# EasyEDA Pro project inverted_board1.eprj

# Schematic Schematic1
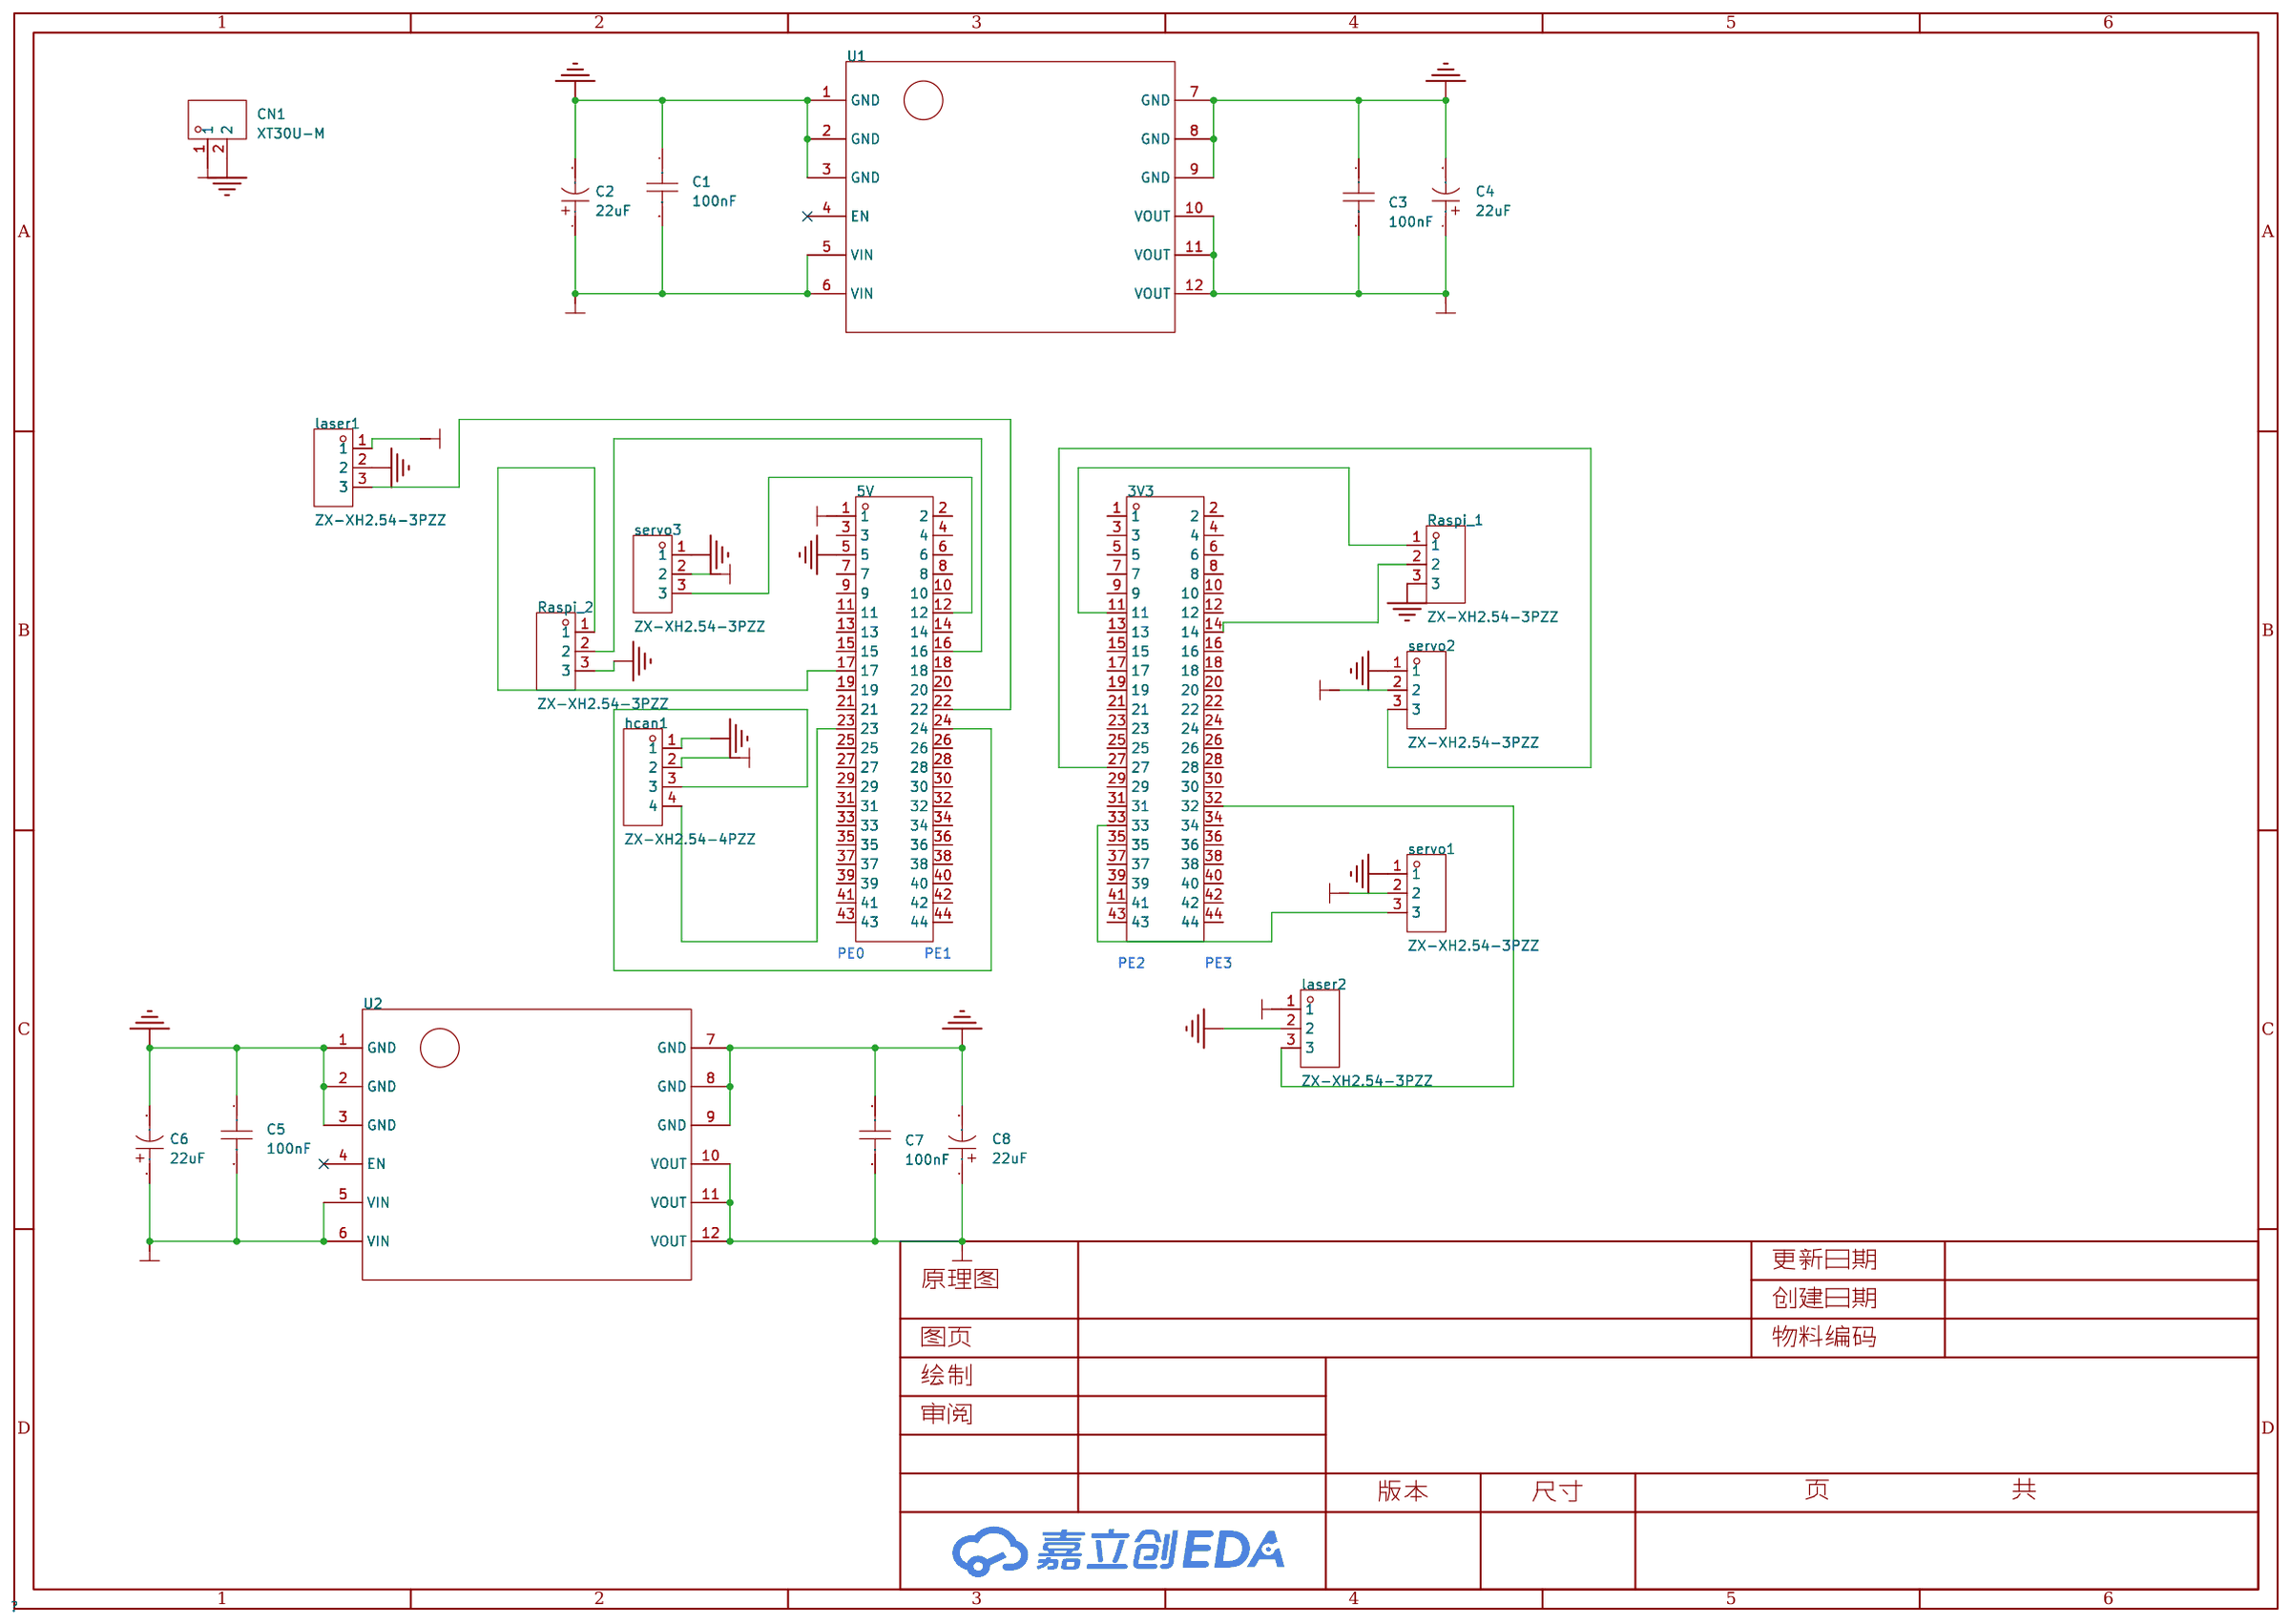
[diagram p0: schematic sheet]

## Parts
3V3  X6521FV-2x22-C85D32  [HDR-TH_44P-P2.54-V-F-R2-C22-S2.54]
5V  X6521FV-2x22-C85D32  [HDR-TH_44P-P2.54-V-F-R2-C22-S2.54]
C1  100nF  [C0603]
C2  22uF  [CAP-TH_BD8.0-P5.00-D0.6-FD]
C3  100nF  [C0603]
C4  22uF  [CAP-TH_BD8.0-P5.00-D0.6-FD]
C5  100nF  [C0603]
C6  22uF  [CAP-TH_BD8.0-P5.00-D0.6-FD]
C7  100nF  [C0603]
C8  22uF  [CAP-TH_BD8.0-P5.00-D0.6-FD]
CN1  XT30U-M  [CONN-TH_XT30U-M]
hcan1  ZX-XH2.54-4PZZ  [CONN-TH_4P-P2.50_4PIN]
laser1  ZX-XH2.54-3PZZ  [CONN-TH_3P-P2.54_2501S-3P]
laser2  ZX-XH2.54-3PZZ  [CONN-TH_3P-P2.54_2501S-3P]
Raspi_1  ZX-XH2.54-3PZZ  [CONN-TH_3P-P2.54_2501S-3P]
Raspi_2  ZX-XH2.54-3PZZ  [CONN-TH_3P-P2.54_2501S-3P]
servo1  ZX-XH2.54-3PZZ  [CONN-TH_3P-P2.54_2501S-3P]
servo2  ZX-XH2.54-3PZZ  [CONN-TH_3P-P2.54_2501S-3P]
servo3  ZX-XH2.54-3PZZ  [CONN-TH_3P-P2.54_2501S-3P]
U1  -  [TPS5430]
U2  -  [TPS5430]

## Library data of the parts
3V3 5V = X6521FV-2x22-C85D32: LCSC Part Name: 间距:2.54mm 2x22P 直插; Supplier Part: C2883995; Manufacturer: XKB Connection(中国星坤); Supplier Footprint: 插件,P=2.54mm; JLCPCB Part Class: 扩展库; Datasheet: https://atta.szlcsc.com/upload/public/pdf/source/20211009/C636DBF0733662F7F428F4420CCBBD46.pdf; Supplier: LCSC; Holes Structure: 2x22P; Pitch: 2.54mm; Row Spacing: 2.54mm; Circular Hole / Square Hole: 方孔; Mounting Type: 直插; Number of Rows: 双排; Number of Holes: 44P; Current Rating (Max): 3A; Voltage Rating (Max): 250V; Holes Direction: 顶部; Insulation Height: 8.5mm; Contact Material: 黄铜; Contact Plating: 金; Operating Temperature Range: -40℃~+105℃; Soldering Temperature(Max): 260℃
C1 C3 C5 C7 = CGA0603X7R104K500JT: LCSC Part Name: 100nF ±10% 50V; Supplier Part: C6119867; Manufacturer: HRE(芯声); Supplier Footprint: 0603; JLCPCB Part Class: 扩展库; Datasheet: https://atta.szlcsc.com/upload/public/pdf/source/20250103/C44077DA9E7B3EFAE02F22B6D3D1CBC9.pdf; Supplier: LCSC; Tolerance: ±10%; Voltage Rating: 50V; Temperature Coefficient: X7R
C2 C4 C6 C8 = CD110226M2G0816VFL: LCSC Part Name: 22uF 400V; Supplier Part: C7499973; Manufacturer: HRK(鸿瑞凯); Supplier Footprint: 插件,D8xL16mm; JLCPCB Part Class: 扩展库; Supplier: LCSC; Voltage Rated: 400V; Diameter: 8mm; Height - Seated (Max): 16mm
CN1 = XT30U-M: LCSC Part Name: AMASS(艾迈斯)轻量版锂电池插头公头 XT30U-M; Supplier Part: C99101; Manufacturer: AMASS(艾迈斯); JLCPCB Part Class: 扩展库; Datasheet: https://atta.szlcsc.com/upload/public/pdf/source/20170606/1496716542582.pdf; Supplier: LCSC; Brand: 艾迈斯; Type: 插头; Colour: 黄色; InterfaceType: 公头
hcan1 = ZX-XH2.54-4PZZ: LCSC Part Name: 1x4P 间距:2.5mm 直插 系列:XH; Supplier Part: C7429634; Manufacturer: Megastar(兆星); Supplier Footprint: 插件,P=2.5mm; JLCPCB Part Class: 扩展库; Datasheet: https://atta.szlcsc.com/upload/public/pdf/source/20230619/B529A2163E0159A644AB3383D208FB03.pdf; Supplier: LCSC; Pins Structure: 1x4P; Pitch: 2.5mm; Mounting Type: 直插; Reference Series: XH; Number of Pins: 4P; Number of Rows: 1; Number of PINs Per Row: 4; Rated Current: 3A; Contact Material: 黄铜; Contact Plating: 锡; Operating Temperature: -25℃~+85℃; Rated Voltage (Max): 250V; Plastic Material: PA66; Flame Retardant Rating: UL94V-0; Color: 白色; Z-Height of the Board: 7mm; X-Length of Bottom Edge on Board (Spacing Line): 12.5mm; Y-Width of Bottom Edge on Board: 5.9mm
laser1 laser2 Raspi_1 Raspi_2 servo1-servo3 = ZX-XH2.54-3PZZ: LCSC Part Name: 1x3P 间距:2.5mm 直插 系列:XH; Supplier Part: C7429633; Manufacturer: Megastar(兆星); Supplier Footprint: 插件,P=2.5mm; JLCPCB Part Class: 扩展库; Datasheet: https://atta.szlcsc.com/upload/public/pdf/source/20230619/AE17037A2CFDBE8D9CBA775D61AD0A84.pdf; Supplier: LCSC; Pins Structure: 1x3P; Pitch: 2.5mm; Mounting Type: 直插; Reference Series: XH; Number of Pins: 3P; Number of Rows: 1; Number of PINs Per Row: 3; Rated Current: 3A; Contact Material: 黄铜; Contact Plating: 锡; Operating Temperature: -25℃~+85℃; Rated Voltage (Max): 250V; Plastic Material: PA66; Flame Retardant Rating: UL94V-0; Color: 白色; Z-Height of the Board: 7mm; X-Length of Bottom Edge on Board (Spacing Line): 10mm; Y-Width of Bottom Edge on Board: 5.9mm
U1 U2 = 12V-5V

## Nets
GND: 5V.5 C1.1 C2.2 C3.1 C4.2 C5.1 C6.2 C7.1 C8.2 CN1.2 hcan1.1 laser1.2 laser2.2 Raspi_1.3 Raspi_2.3 servo1.1 servo2.1 servo3.1 U1.1(GND) U1.2(GND) U1.3(GND) U1.7(GND) U1.8(GND) U1.9(GND) U2.1(GND) U2.2(GND) U2.3(GND) U2.7(GND) U2.8(GND) U2.9(GND)
VIN: C1.2 C2.1 C5.2 C6.1 CN1.1 U1.5(VIN) U1.6(VIN) U2.5(VIN) U2.6(VIN)
VOUT_H: C3.2 C4.1 servo1.2 servo2.2 servo3.2 U1.10(VOUT) U1.11(VOUT) U1.12(VOUT)
VOUT_L: 5V.1 C7.2 C8.1 hcan1.2 laser1.1 laser2.1 U2.10(VOUT) U2.11(VOUT) U2.12(VOUT)
$1N1101: 3V3.33 servo1.3
$1N1110: 3V3.27 servo2.3
$1N3348: 3V3.11 Raspi_1.1
$1N3403: 5V.17 Raspi_2.1
$1N8114: 5V.24 hcan1.3
$1N8149: 5V.23 hcan1.4
$1N8238: 3V3.14 Raspi_1.2
$1N8269: 3V3.32 laser2.3
$1N8276: 5V.12 servo3.3
$1N8294: 5V.16 Raspi_2.2
$1N10314: 5V.22 laser1.3

Not connected (* = marked no-connect by the designer): 3V3 1 2 3 4 5 6 7 8 9 10 12 13 15 16 17 18 19 20 21 22 23 24 25 26 28 29 30 31 34 35 36 37 38 39 40 41 42 43 44; 5V 2 3 4 6 7 8 9 10 11 13 14 15 18 19 20 21 25 26 27 28 29 30 31 32 33 34 35 36 37 38 39 40 41 42 43 44; U1 4(EN)*; U2 4(EN)*

## Notes on the sheet
- PE0
- PE1
- PE2
- PE3

# Board PCB1
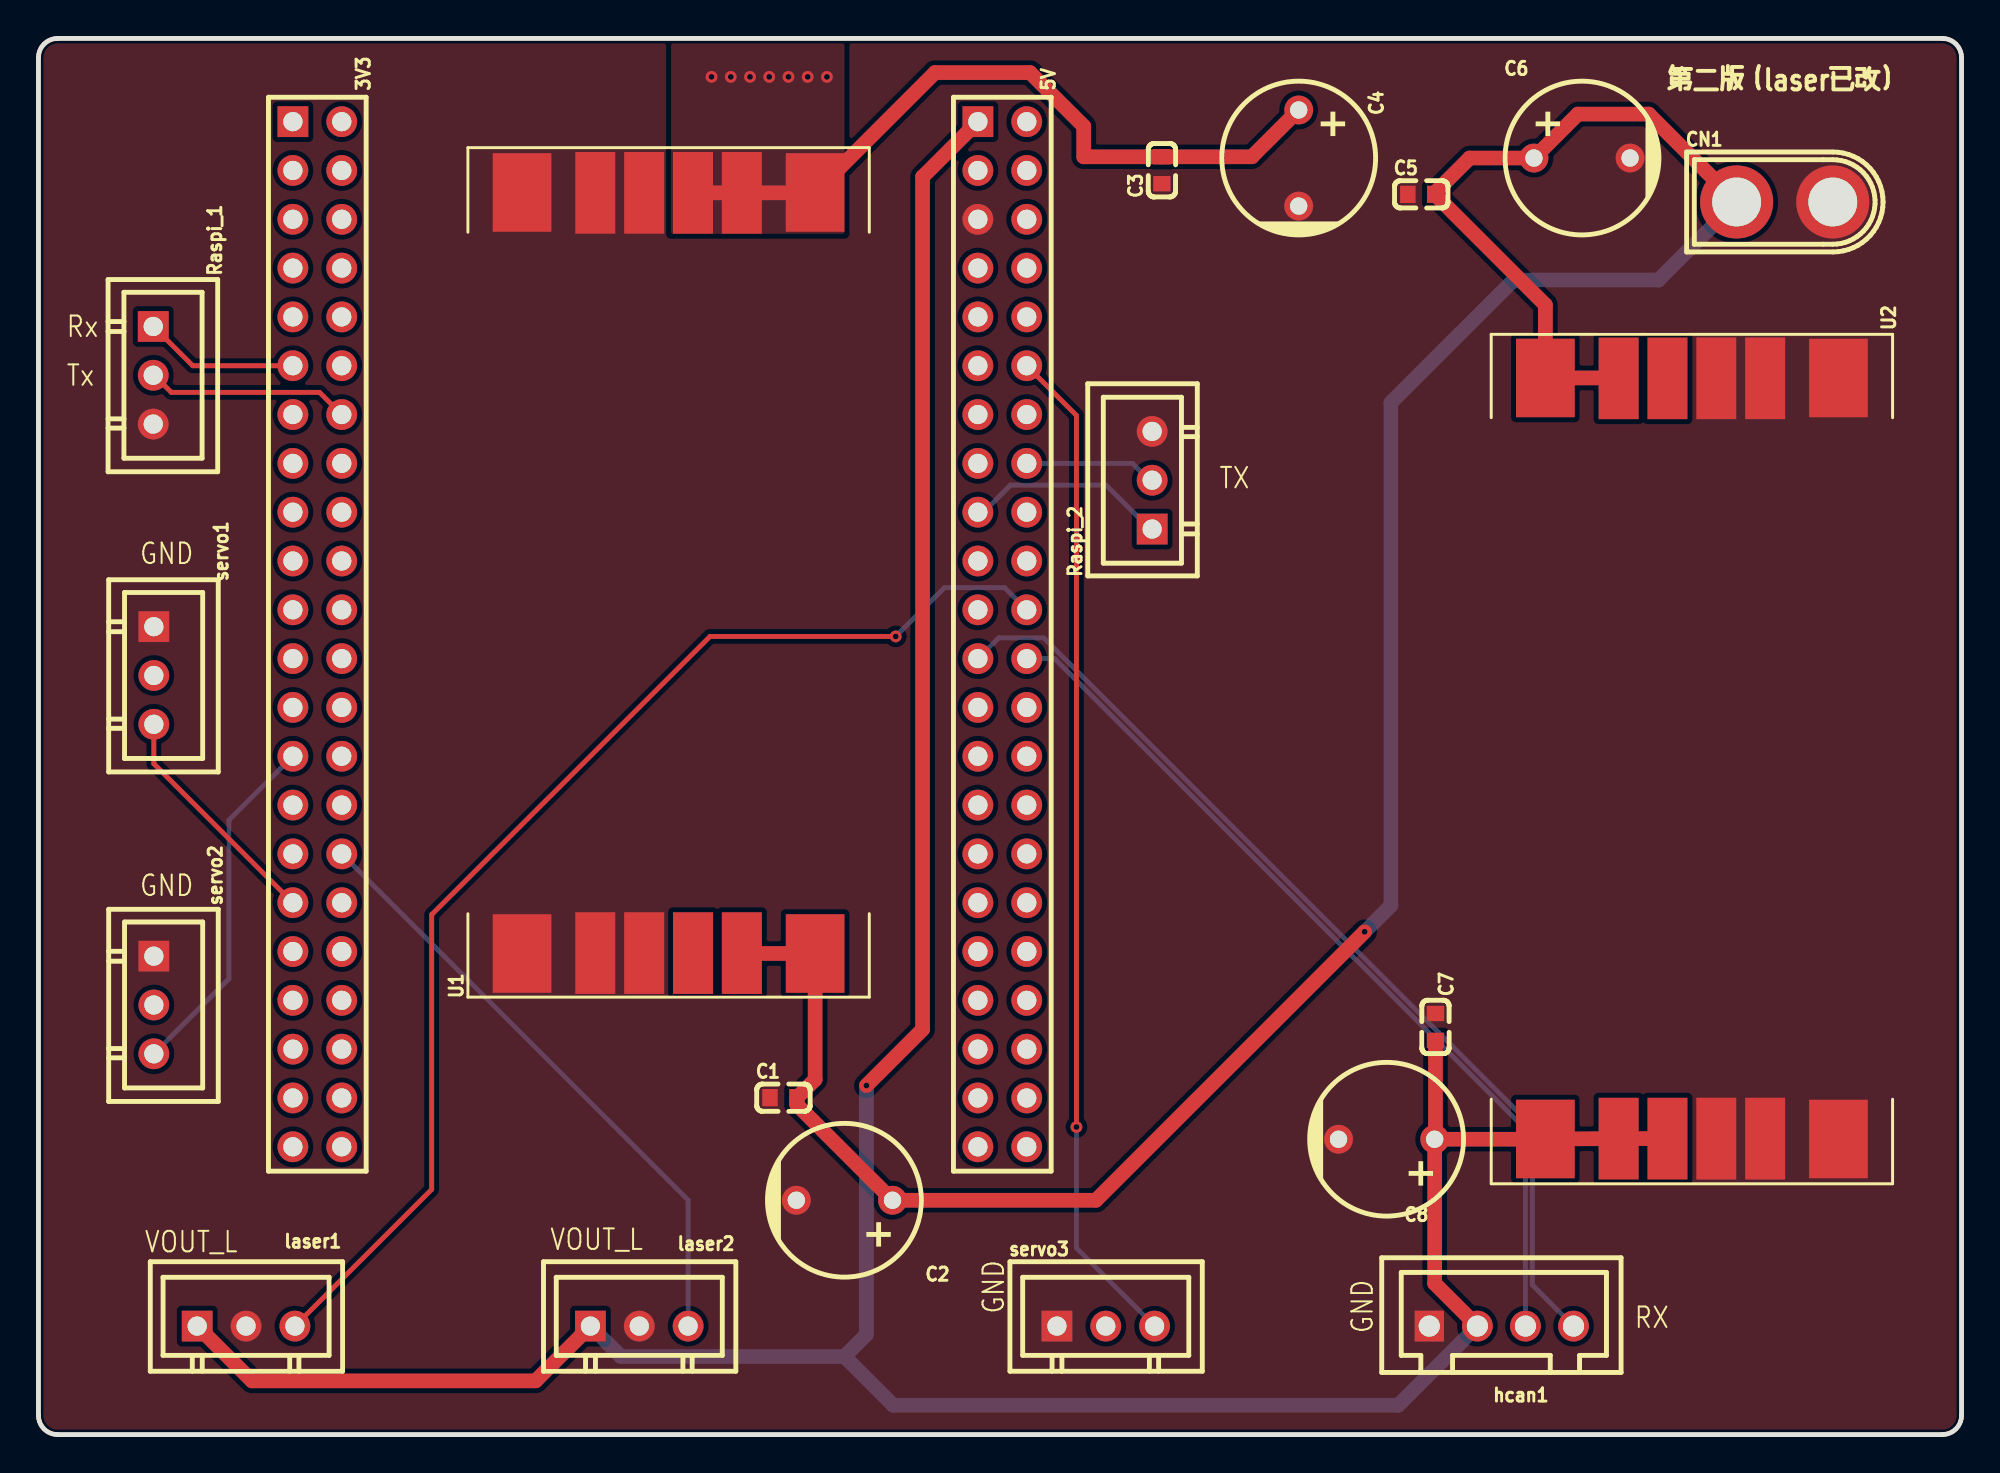
[diagram p1: board, top side]
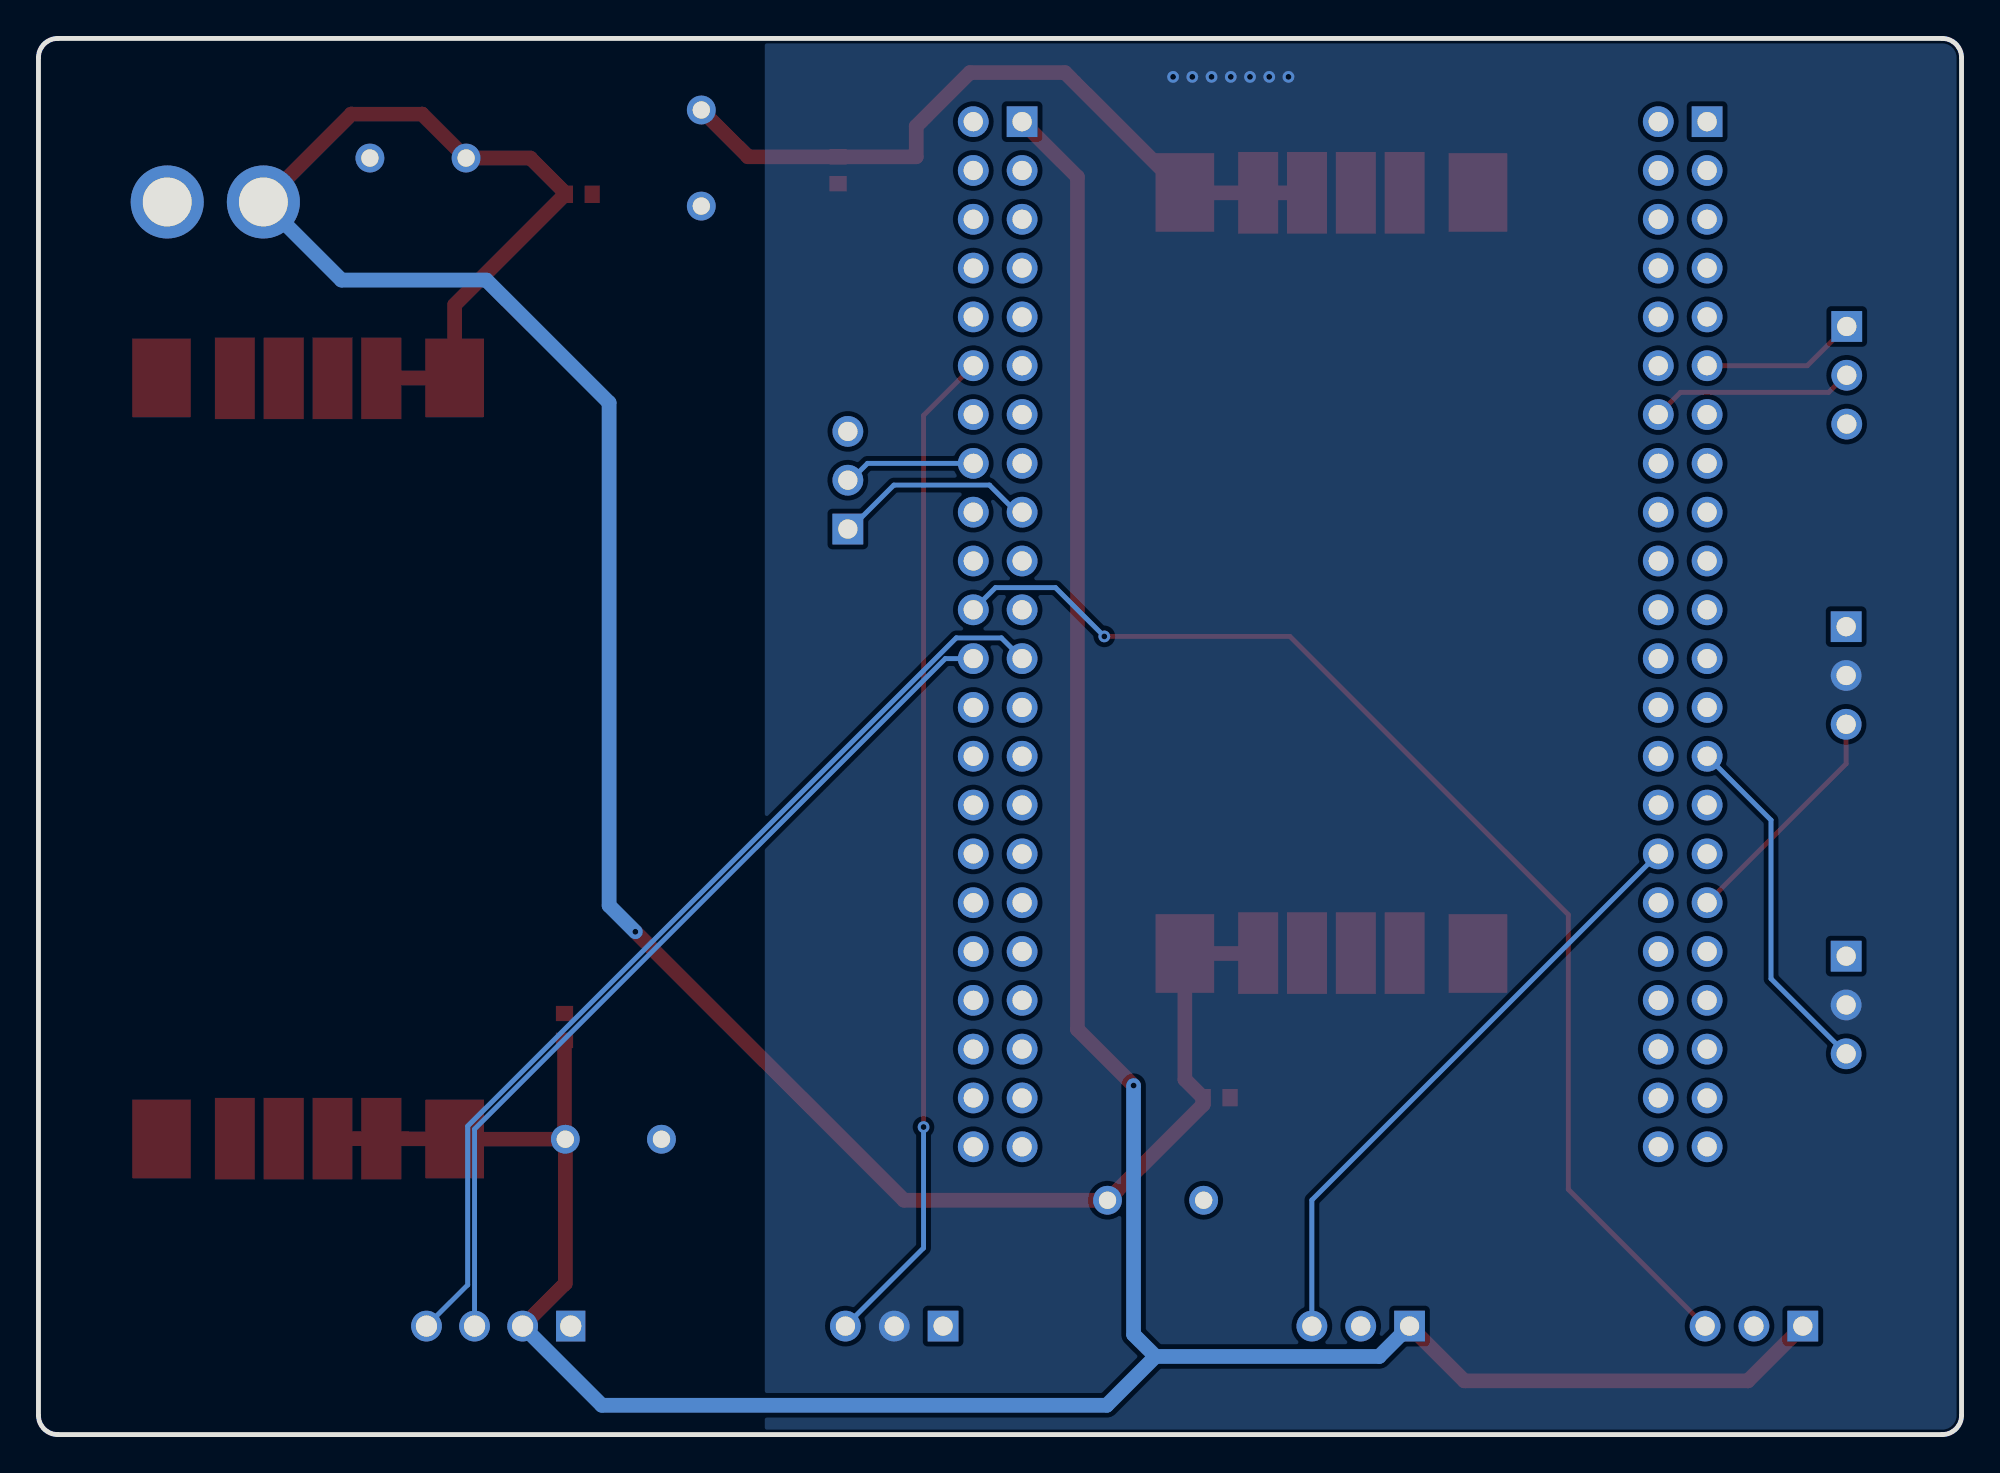
[diagram p2: board, bottom side, seen from below]

Outline 100 x 72.64 mm; copper layers: Top Layer, Bottom Layer. Coordinates in mm from the lower left corner of the outline.
Outline path: 0,71.64 0,1 arc(0.29,0.29) 1,0 99,0 arc(99.71,0.29) 100,1 100,71.64 arc(99.71,72.35) 99,72.64 1,72.64 arc(0.29,72.35) 0,71.64
Stack: Top Layer 0.035mm / Dielectric1 1.51mm FR4 er 4.5 / Bottom Layer 0.035mm

## Design rules (mm)
template: 自定义配置
spacing copperThickness1oz (default): track to track 0.102, other pairs 0.152 to 0.3
spacing copperThickness2oz: track to track 0.203, other pairs 0.152 to 0.3
track width copperThickness1oz (default): min 0.127, default 0.254, max 2.54
track width copperThickness2oz: min 0.203, default 0.254, max 2.54
differential pair differentialPair (default): width min 0.127, default 0.254, max 2.54; gap min 0.152, default 0.152
via viaSize (default): diameter min 0.5, default 0.61, max 10; hole min 0.3, default 0.305, max 6.3

## Placement (name value [footprint] x y rotation side)
3V3  X6521FV-2x22-C85D32  [HDR-TH_44P-P2.54-V-F-R2-C22-S2.54]  14.5 41.64 270 top
5V  X6521FV-2x22-C85D32  [HDR-TH_44P-P2.54-V-F-R2-C22-S2.54]  50.12 41.64 270 top
C1  100nF  [C0603]  38.74 17.53 0 top
C2  22uF  [CAP-TH_BD8.0-P5.00-D0.6-FD]  41.91 12.19 180 top
C3  100nF  [C0603]  58.42 65.79 90 top
C4  22uF  [CAP-TH_BD8.0-P5.00-D0.6-FD]  65.53 66.42 270 top
C5  100nF  [C0603]  71.91 64.53 0 top
C6  22uF  [CAP-TH_BD8.0-P5.00-D0.6-FD]  80.26 66.42 0 top
C7  100nF  [C0603]  72.64 21.21 270 top
C8  22uF  [CAP-TH_BD8.0-P5.00-D0.6-FD]  70.1 15.37 180 top
CN1  XT30U-M  [CONN-TH_XT30U-M]  90.81 64.14 0 top
hcan1  ZX-XH2.54-4PZZ  [CONN-TH_4P-P2.50_4PIN]  76.07 5.64 0 top
laser1  ZX-XH2.54-3PZZ  [CONN-TH_3P-P2.54_2501S-3P]  10.8 5.64 0 top
laser2  ZX-XH2.54-3PZZ  [CONN-TH_3P-P2.54_2501S-3P]  31.24 5.64 0 top
Raspi_1  ZX-XH2.54-3PZZ  [CONN-TH_3P-P2.54_2501S-3P]  5.97 55.12 270 top
Raspi_2  ZX-XH2.54-3PZZ  [CONN-TH_3P-P2.54_2501S-3P]  57.91 49.66 90 top
servo1  ZX-XH2.54-3PZZ  [CONN-TH_3P-P2.54_2501S-3P]  6 39.5 270 top
servo2  ZX-XH2.54-3PZZ  [CONN-TH_3P-P2.54_2501S-3P]  6 22.35 270 top
servo3  ZX-XH2.54-3PZZ  [CONN-TH_3P-P2.54_2501S-3P]  55.5 5.64 0 top
U1  -  [TPS5430]  32.77 44.83 90 top
U2  -  [TPS5430]  85.98 35.18 270 top

## Footprints (pads in the part's own frame, mm; a bottom-side part is the same pattern mirrored in y, then rotated)
C0603
  rect 0.8x0.9 smd: 1(-0.7,0) 2(0.7,0)
CAP-TH_BD8.0-P5.00-D0.6-FD
  round 1.5 hole 0.9: 1(-2.5,0) 2(2.5,0)
CONN-TH_3P-P2.54_2501S-3P
  rect 1.6x1.6 hole 1: 1(-2.54,0)
  round 1.6 hole 1: 2(0,0) 3(2.54,0)
CONN-TH_4P-P2.50_4PIN
  rect 1.524x1.6 hole 1.1: 1(-3.75,0)
  round 1.6 hole 1.1: 2(-1.25,0) 3(1.25,0) 4(3.75,0)
CONN-TH_XT30U-M
  round 3.8 hole 2.54: 1(-2.5,0) 2(2.5,0)
HDR-TH_44P-P2.54-V-F-R2-C22-S2.54
  rect 1.6x1.6 hole 1: 1(-26.67,-1.27)
  round 1.6 hole 1: 2(-26.67,1.27) 3(-24.13,-1.27) 4(-24.13,1.27) 5(-21.59,-1.27) 6(-21.59,1.27) 7(-19.05,-1.27) 8(-19.05,1.27) 9(-16.51,-1.27) 10(-16.51,1.27) 11(-13.97,-1.27) 12(-13.97,1.27) 13(-11.43,-1.27) 14(-11.43,1.27) 15(-8.89,-1.27) 16(-8.89,1.27) 17(-6.35,-1.27) 18(-6.35,1.27) 19(-3.81,-1.27) 20(-3.81,1.27) 21(-1.27,-1.27) 22(-1.27,1.27) 23(1.27,-1.27) 24(1.27,1.27) 25(3.81,-1.27) 26(3.81,1.27) 27(6.35,-1.27) 28(6.35,1.27) 29(8.89,-1.27) 30(8.89,1.27) 31(11.43,-1.27) 32(11.43,1.27) 33(13.97,-1.27) 34(13.97,1.27) 35(16.51,-1.27) 36(16.51,1.27) 37(19.05,-1.27) 38(19.05,1.27) 39(21.59,-1.27) 40(21.59,1.27) 41(24.13,-1.27) 42(24.13,1.27) 43(26.67,-1.27) 44(26.67,1.27)
TPS5430
  rect 4.089x3.05 smd: 1(-19.799,7.62) 6(-19.799,-7.62) 7(19.799,7.62) 12(19.799,-7.62)
  rect 4.249x2.08 smd: 2(-19.779,3.81) 3(-19.779,1.27) 4(-19.779,-1.27) 5(-19.779,-3.81) 8(19.779,3.81) 9(19.779,1.27) 10(19.779,-1.27) 11(19.779,-3.81)

## Nets
As in the schematic.

Pads without a net: 3V3 1 2 3 4 5 6 7 8 9 10 12 13 15 16 17 18 19 20 21 22 23 24 25 26 28 29 30 31 34 35 36 37 38 39 40 41 42 43 44; 5V 2 3 4 6 7 8 9 10 11 13 14 15 18 19 20 21 25 26 27 28 29 30 31 32 33 34 35 36 37 38 39 40 41 42 43 44; U1 4; U2 4

## Via types
v1: diameter 0.61, hole 0.305, Top Layer to Bottom Layer, 11 vias

## Routing (per net, layer and track width the routed paths; a pad name or vN(x,y) marks a point on that pad's centre or on a via; arc(x,y) is an arc through that point)
GND: length 0.1
  Top Layer w0.762: 10.8,5.72 laser1.2
VIN: length 135
  Top Layer w0.762: CN1.1 83.73,68.71 80.05,68.71 C6.1 74.42,66.42 72.6,64.6 C5.2 78.36,58.78 U2.6 82.15,54.98 U2.5 ; U1.5 36.6,25.03 U1.6 40.39,18.48 C1.2 39.44,17.16 C2.1 54.99,12.19 v1(68.96,26.16)
  Bottom Layer w0.762: v1(68.96,26.16) 70.33,27.53 70.33,53.69 76.71,60.07 84.24,60.07 CN1.1
VOUT_H: length 37.8
  Top Layer w0.762: U1.10 U1.11 40.37,64.61 U1.12 46.62,70.87 51.56,70.87 54.36,68.07 54.36,66.49 C3.2 63.1,66.49 C4.1
  vias: v1(35,70.64) v1(36,70.64) v1(37,70.64) v1(38,70.64) v1(39,70.64) v1(40,70.64) v1(41,70.64)
VOUT_L: length 167.4
  Top Layer w0.762: 5V.1 45.97,65.44 45.97,21.08 v1(43.05,18.16) ; C8.1 78.35,15.37 U2.12 U2.11 U2.10 ; C8.1 72.6,7.86 hcan1.2 ; C8.1 72.64,15.41 C7.2 ; laser2.1 25.85,2.79 11.11,2.79 laser1.1
  Bottom Layer w0.762: laser2.1 30.28,4.06 41.91,4.06 ; 41.91,4.06 44.45,1.52 70.7,1.52 hcan1.2 ; 41.91,4.06 43.05,5.21 v1(43.05,18.16)
$1N1101: length 12.3
  Top Layer w0.254: 3V3.33 6,34.9 servo1.3
$1N1110: length 18.5
  Bottom Layer w0.254: 3V3.27 9.91,31.97 9.91,23.72 servo2.3
$1N3348: length 8.1
  Top Layer w0.254: 3V3.11 8.02,55.61 6,57.64
$1N3403: length 10.6
  Bottom Layer w0.254: 5V.17 49.14,47.99 50.55,49.4 55.52,49.4 57.91,47.01
$1N8114: length 46.3
  Bottom Layer w0.254: hcan1.3 77.32,15.9 52.84,40.37 5V.24
$1N8149: length 51.1
  Bottom Layer w0.254: 5V.23 49.93,41.45 52.27,41.45 77.68,16.05 77.68,7.79 hcan1.4
$1N8238: length 10.6
  Top Layer w0.254: 3V3.14 14.61,54.23 6.91,54.23 6,55.14
$1N8269: length 32
  Bottom Layer w0.254: laser2.3 33.78,12.2 3V3.32
$1N8276: length 52.7
  Top Layer w0.254: 5V.12 53.97,53.03 v1(53.97,16)
  Bottom Layer w0.254: servo3.3 53.97,9.71 v1(53.97,16)
$1N8294: length 6.9
  Bottom Layer w0.254: 5V.16 56.89,50.53 57.91,49.51
$1N10314: length 62.8
  Top Layer w0.254: v1(44.58,41.53) 34.93,41.53 20.45,27.05 20.45,12.76 laser1.3
  Bottom Layer w0.254: v1(44.58,41.53) 47.12,44.07 50.24,44.07 5V.22

## Copper pours and planes (outline as drawn; the poured copper is in the pictures)
GND on Top Layer: -21.21,84.58 116.59,84.58 116.59,-13.72 -21.21,-13.72
VOUT_H on Top Layer: 32.89,75.18 41.91,75.18 41.91,62.48 32.89,62.48
VOUT_H on Bottom Layer: -3.81,73.79 62.23,73.79 62.23,-3.68 -3.81,-3.68

## Text on the board
Top Silkscreen Layer: Rx | Tx | GND | VOUT_L | TX | RX | 第二版（laser已改）
